# Altium schematic sheet Schematic.SchDoc
size A4; SheetNumber: 1; SheetTotal: 1
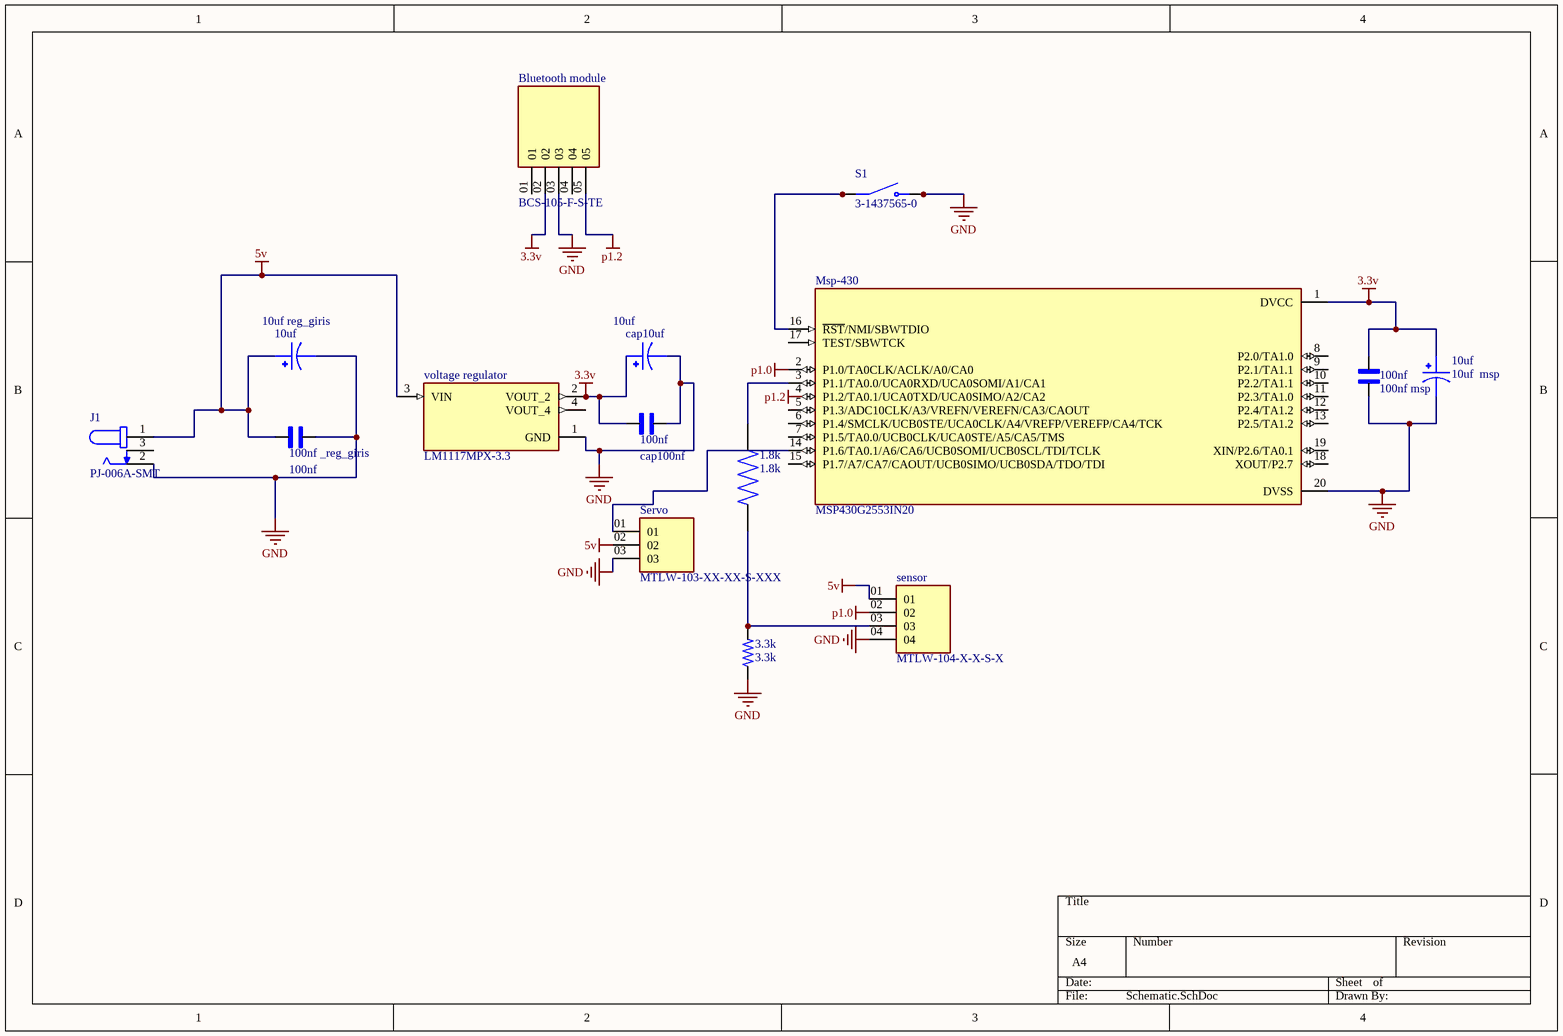
[diagram p0: Schematic.SchDoc]

## Parts
(Parts that share a designator on the sheet are numbered #1, #2 ... from top to bottom, then left to right.)
1.8k  1.8k  [RESC3216X75N]
3.3k  3.3k  [RESC3115X65N]
10uf#1  10uf reg_giris  [CAPPRD200W50D550H1250]
10uf#2  10uf  msp  [CAPPRD200W50D550H1250]
100nf#1  100nf msp  [CAPRR254W50L508T317H508]
100nf#2  100nf _reg_giris  [CAPRR254W50L508T317H508]
Bluetooth_module  BCS-105-F-S-TE  [SAMTEC_BCS-105-F-S-TE]
cap10uf  10uf  [CAPPRD200W50D550H1250]
cap100nf  100nf  [CAPRR254W50L508T317H508]
J1  PJ-006A-SMT  [CUI_PJ-006A-SMT]
Msp-430  MSP430G2553IN20  [DIP794W45P254L2540H508Q20]
S1  3-1437565-0  [SW_3-1437565-0]
sensor  MTLW-104-X-X-S-X  [SAMTEC_MTLW-104-X-X-S-X]
Servo  MTLW-103-XX-XX-S-XXX  [SAMTEC_MTLW-103-XX-XX-S-XXX]
voltage_regulator  LM1117MPX-3.3  [VREG_LM1117MPX-3.3]

## Nets
3.3v: 10uf#2.1 100nf#1.2 Bluetooth_module.02 cap10uf.1 cap100nf.1 Msp-430.1(DVCC) voltage_regulator.2(VOUT_2)
5v: 10uf#1.1 100nf#2.1 J1.1 sensor.01 Servo.02 voltage_regulator.3(VIN)
GND: 3.3k.1 10uf#1.2 10uf#2.2 100nf#1.1 100nf#2.2 Bluetooth_module.03 cap10uf.2 cap100nf.2 J1.2 Msp-430.20(DVSS) S1.3(NO) S1.4(NO) sensor.04 Servo.03 voltage_regulator.1(GND)
p1.0: Msp-430.2(P1.0/TA0CLK/ACLK/A0/CA0) sensor.02
p1.2: Bluetooth_module.05
Net1.8k_1: 1.8k.1 3.3k.2 sensor.03
Net1.8k_2: 1.8k.2 Msp-430.3(P1.1/TA0.0/UCA0RXD/UCA0SOMI/A1/CA1)
NetMsp-430_14: Msp-430.14(P1.6/TA0.1/A6/CA6/UCB0SOMI/UCB0SCL/TDI/TCLK) Servo.01
NetMsp-430_16: Msp-430.16(~{RST}/NMI/SBWTDIO) S1.1(COM) S1.2(COM)

Not connected (* = marked no-connect by the designer): Bluetooth_module 01 04; J1 3; Msp-430 4(P1.2/TA0.1/UCA0TXD/UCA0SIMO/A2/CA2) 5(P1.3/ADC10CLK/A3/VREFN/VEREFN/CA3/CAOUT) 6(P1.4/SMCLK/UCB0STE/UCA0CLK/A4/VREFP/VEREFP/CA4/TCK) 7(P1.5/TA0.0/UCB0CLK/UCA0STE/A5/CA5/TMS) 8(P2.0/TA1.0) 9(P2.1/TA1.1) 10(P2.2/TA1.1) 11(P2.3/TA1.0) 12(P2.4/TA1.2) 13(P2.5/TA1.2) 15(P1.7/A7/CA7/CAOUT/UCB0SIMO/UCB0SDA/TDO/TDI) 17(TEST/SBWTCK) 18(XOUT/P2.7) 19(XIN/P2.6/TA0.1); voltage_regulator 4(VOUT_4)

## Notes on the sheet
- Labels drawn without touching a wire or pin: p1.2

## Library data of the parts
1.8k = CR1206-JW-182ELF: MF: {'manufacturer': u'Bourns'}; Package: None; Price: None; Value: *; MP: CR1206-JW-182ELF; Availability: Unavailable
3.3k = 4-2176245-3: MF: {'manufacturer': u'TE Connectivity'}; Package: None; Price: None; Value: *; MP: 4-2176245-3; Availability: Unavailable
10uf#1 10uf#2 cap10uf = UVR1V100MDD: MF: {'manufacturer': u'Nichicon'}; Package: None; Price: None; Value: *; MP: UVR1V100MDD; Availability: Unavailable
100nf#1 100nf#2 cap100nf = SR291C104KARTR1: MF: {'manufacturer': u'AVX'}; Package: None; Price: None; Value: *; MP: SR291C104KARTR1; Availability: Unavailable
Bluetooth_module = BCS-105-F-S-TE: MF: {'manufacturer': u'Samtec'}; Package: None; Price: None; Value: *; MP: BCS-105-F-S-TE; Availability: Unavailable
J1 = PJ-006A-SMT: MF: {'manufacturer': u'Same Sky'}; Package: None; Price: None; Value: *; MP: PJ-006A-SMT; Availability: Unavailable
Msp-430 = MSP430G2553IN20: MF: {'manufacturer': u'Texas Instruments'}; Package: None; Price: None; Value: *; MP: MSP430G2553IN20; Availability: Unavailable
S1 = 3-1437565-0: MF: {'manufacturer': u'TE Connectivity'}; Package: None; Price: None; Value: *; MP: 3-1437565-0; Availability: Unavailable
sensor = MTLW-104-X-X-S-X: MF: {'manufacturer': u'Samtec'}; Package: None; Price: None; Value: *; MP: MTLW-104-X-X-S-X; Availability: Unavailable
Servo = MTLW-103-XX-XX-S-XXX: MF: {'manufacturer': u'Samtec'}; Package: None; Price: None; Value: *; MP: MTLW-103-XX-XX-S-XXX; Availability: Unavailable
voltage_regulator = LM1117MPX-3.3: MF: {'manufacturer': u'Texas Instruments'}; Package: None; Price: None; Value: *; MP: LM1117MPX-3.3; Availability: Unavailable